# Altium schematic sheet 3.3V Switch Mode PSU (5V disabled).SchDoc
size A4
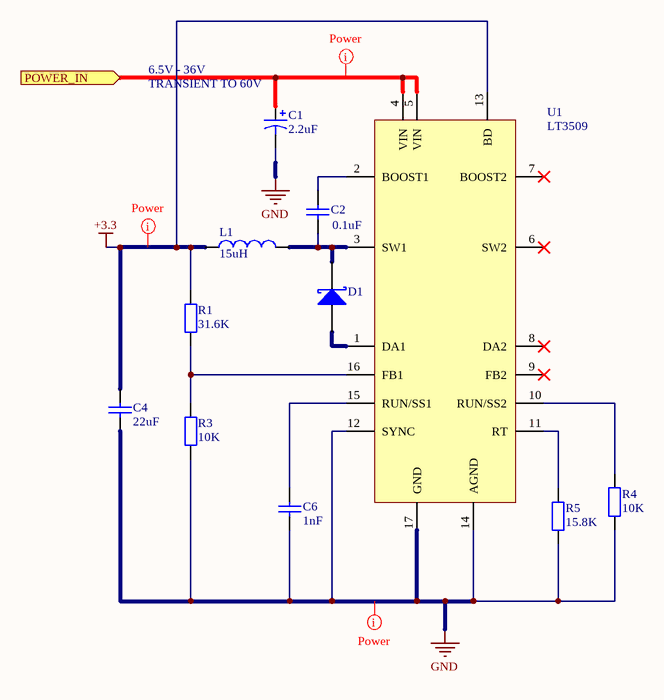
[diagram p0: 3.3V Switch Mode PSU (5V disabled).SchDoc]

## Parts
C1  value 2.2uF  [EEEHC1H2R2R]  (hidden comment: Cap Pol1)
C2  value 0.1uF  [C0603]  (hidden comment: Cap)
C4  value 22uF  [C0805]  (hidden comment: Cap)
C6  value 1nF  [C0603]  (hidden comment: Cap)
D1  D Schottky  [VS-10BQ030TRPBF]  (value not drawn)
L1  value 15uH  [SDR0604-150YL]  (hidden comment: Inductor)
R1  value 31.6K  [R0603]  (hidden comment: Res)
R3  value 10K  [R0603]  (hidden comment: Res)
R4  value 10K  [R0603]  (hidden comment: Res)
R5  value 15.8K  [R0603]  (hidden comment: Res)
U1  LT3509  [LT3509]

## Ports
POWER_IN (in)

## Nets
+3.3: C4.1 L1.1 R1.2 U1.13(BD)
GND: C1.2 C4.2 C6.2 R3.1 R4.1 R5.1 U1.12(SYNC) U1.14(AGND) U1.17(GND)
POWER_IN: C1.1 U1.4(VIN) U1.5(VIN) ; port POWER_IN
NetC2_1: C2.1 D1.2(K) L1.2 U1.3(SW1)
NetC2_2: C2.2 U1.2(BOOST1)
NetC6_1: C6.1 U1.15(RUN/SS1)
NetD1_1: D1.1(A) U1.1(DA1)
NetR1_1: R1.1 R3.2 U1.16(FB1)
NetR4_2: R4.2 U1.10(RUN/SS2)
NetR5_2: R5.2 U1.11(RT)

Not connected (* = marked no-connect by the designer): U1 6(SW2)* 7(BOOST2)* 8(DA2)* 9(FB2)*

## Layout directives
net class Power: +3.3, GND, POWER_IN

## Notes on the sheet
- 6.5V - 36V
- (near C1) TRANSIENT TO 60V

## Library data of the parts
C1 = Cap Pol1: Polarized Capacitor (Radial); Published: 8-Jun-2000; LatestRevisionDate: 17-Jul-2002; LatestRevisionNote: Re-released for DXP Platform.; PackageReference: RB7.6-15; Publisher: Altium Limited; farnell: 1714713
C2 C4 C6 = Cap: Capacitor
  C2: Published: 8-Jun-2000; LatestRevisionDate: 17-Jul-2002; LatestRevisionNote: Re-released for DXP Platform.; PackageReference: RAD-0.3; Publisher: Altium Limited; farnell: 1759122
  C4: farnell: 1867955
  C6: farnell: 1759088
D1 = D Schottky: Schottky Diode; Published: 8-Jun-2000; LatestRevisionDate: 17-Jul-2002; LatestRevisionNote: Re-released for DXP Platform.; PackageReference: SMB; Publisher: Altium Limited; Code_JEDEC: DO-214-AA; farnell: 9100687
L1 = Inductor: Code_IEC: 1005; Published: 8-Jun-2000; LatestRevisionDate: 29-May-2009; LatestRevisionNote: IPC-7351 Footprint Added.; PackageReference: 0402-A; Publisher: Altium Limited; PackageDescription: Chip Inductor; Code_JEITA: 0402; farnell: 1828004
R1 R3-R5 = Res2: Resistor
  R1: farnell: 1170937
  R3 R4: farnell: 1576297
  R5: farnell: 1170905
U1 = LT3509: digikey: LT3509EMSE#PBF-ND